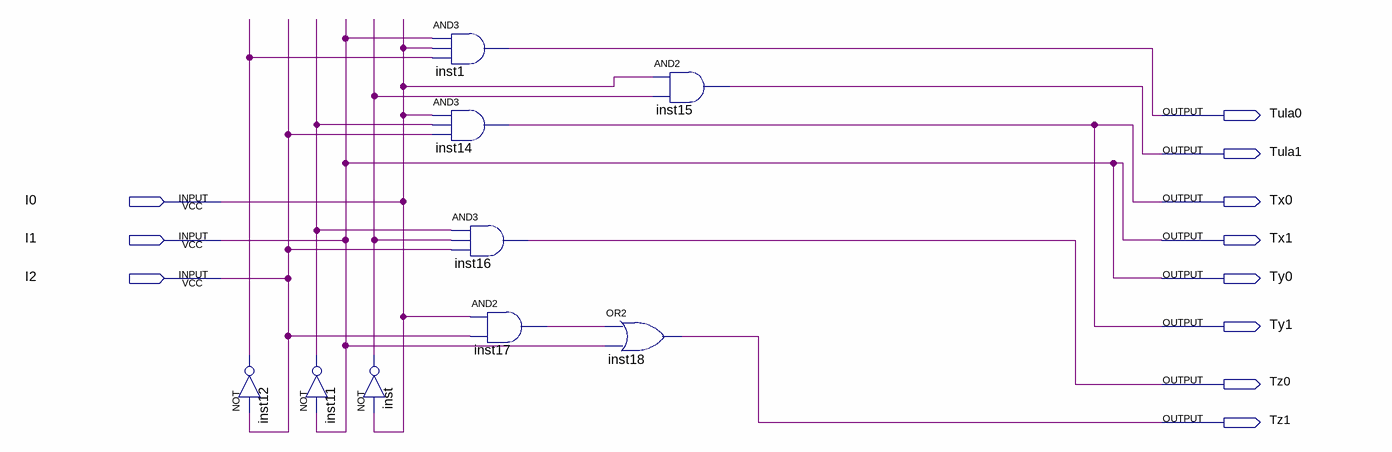
[diagram p0: schematic sheet]
// Quartus schematic UC.bdf as structural Verilog: 9 symbols, 11 pins
module UC (
  input  I0,
  input  I1,
  input  I2,
  output Tula0,
  output Tula1,
  output Tx0,
  output Tx1,
  output Ty0,
  output Ty1,
  output Tz0,
  output Tz1
);

  wire inst11_out, inst12_out, inst17_out, inst_out;

  not inst12 (inst12_out, I2);
  not inst11 (inst11_out, I1);
  not inst (inst_out, I0);
  and inst1 (Tula0, I1, I0, inst12_out);
  and inst14 (Tx0, I0, inst11_out, I2);
  and inst16 (Tz0, inst11_out, inst_out, I2);
  and inst17 (inst17_out, I0, I2);
  or inst18 (Tz1, inst17_out, I1);
  and inst15 (Tula1, I0, inst_out);

  assign Tx1 = I1;
  assign Ty0 = I1;
  assign Ty1 = Tx0;
endmodule
